# Altium schematic sheet Shema.SchDoc
size A3
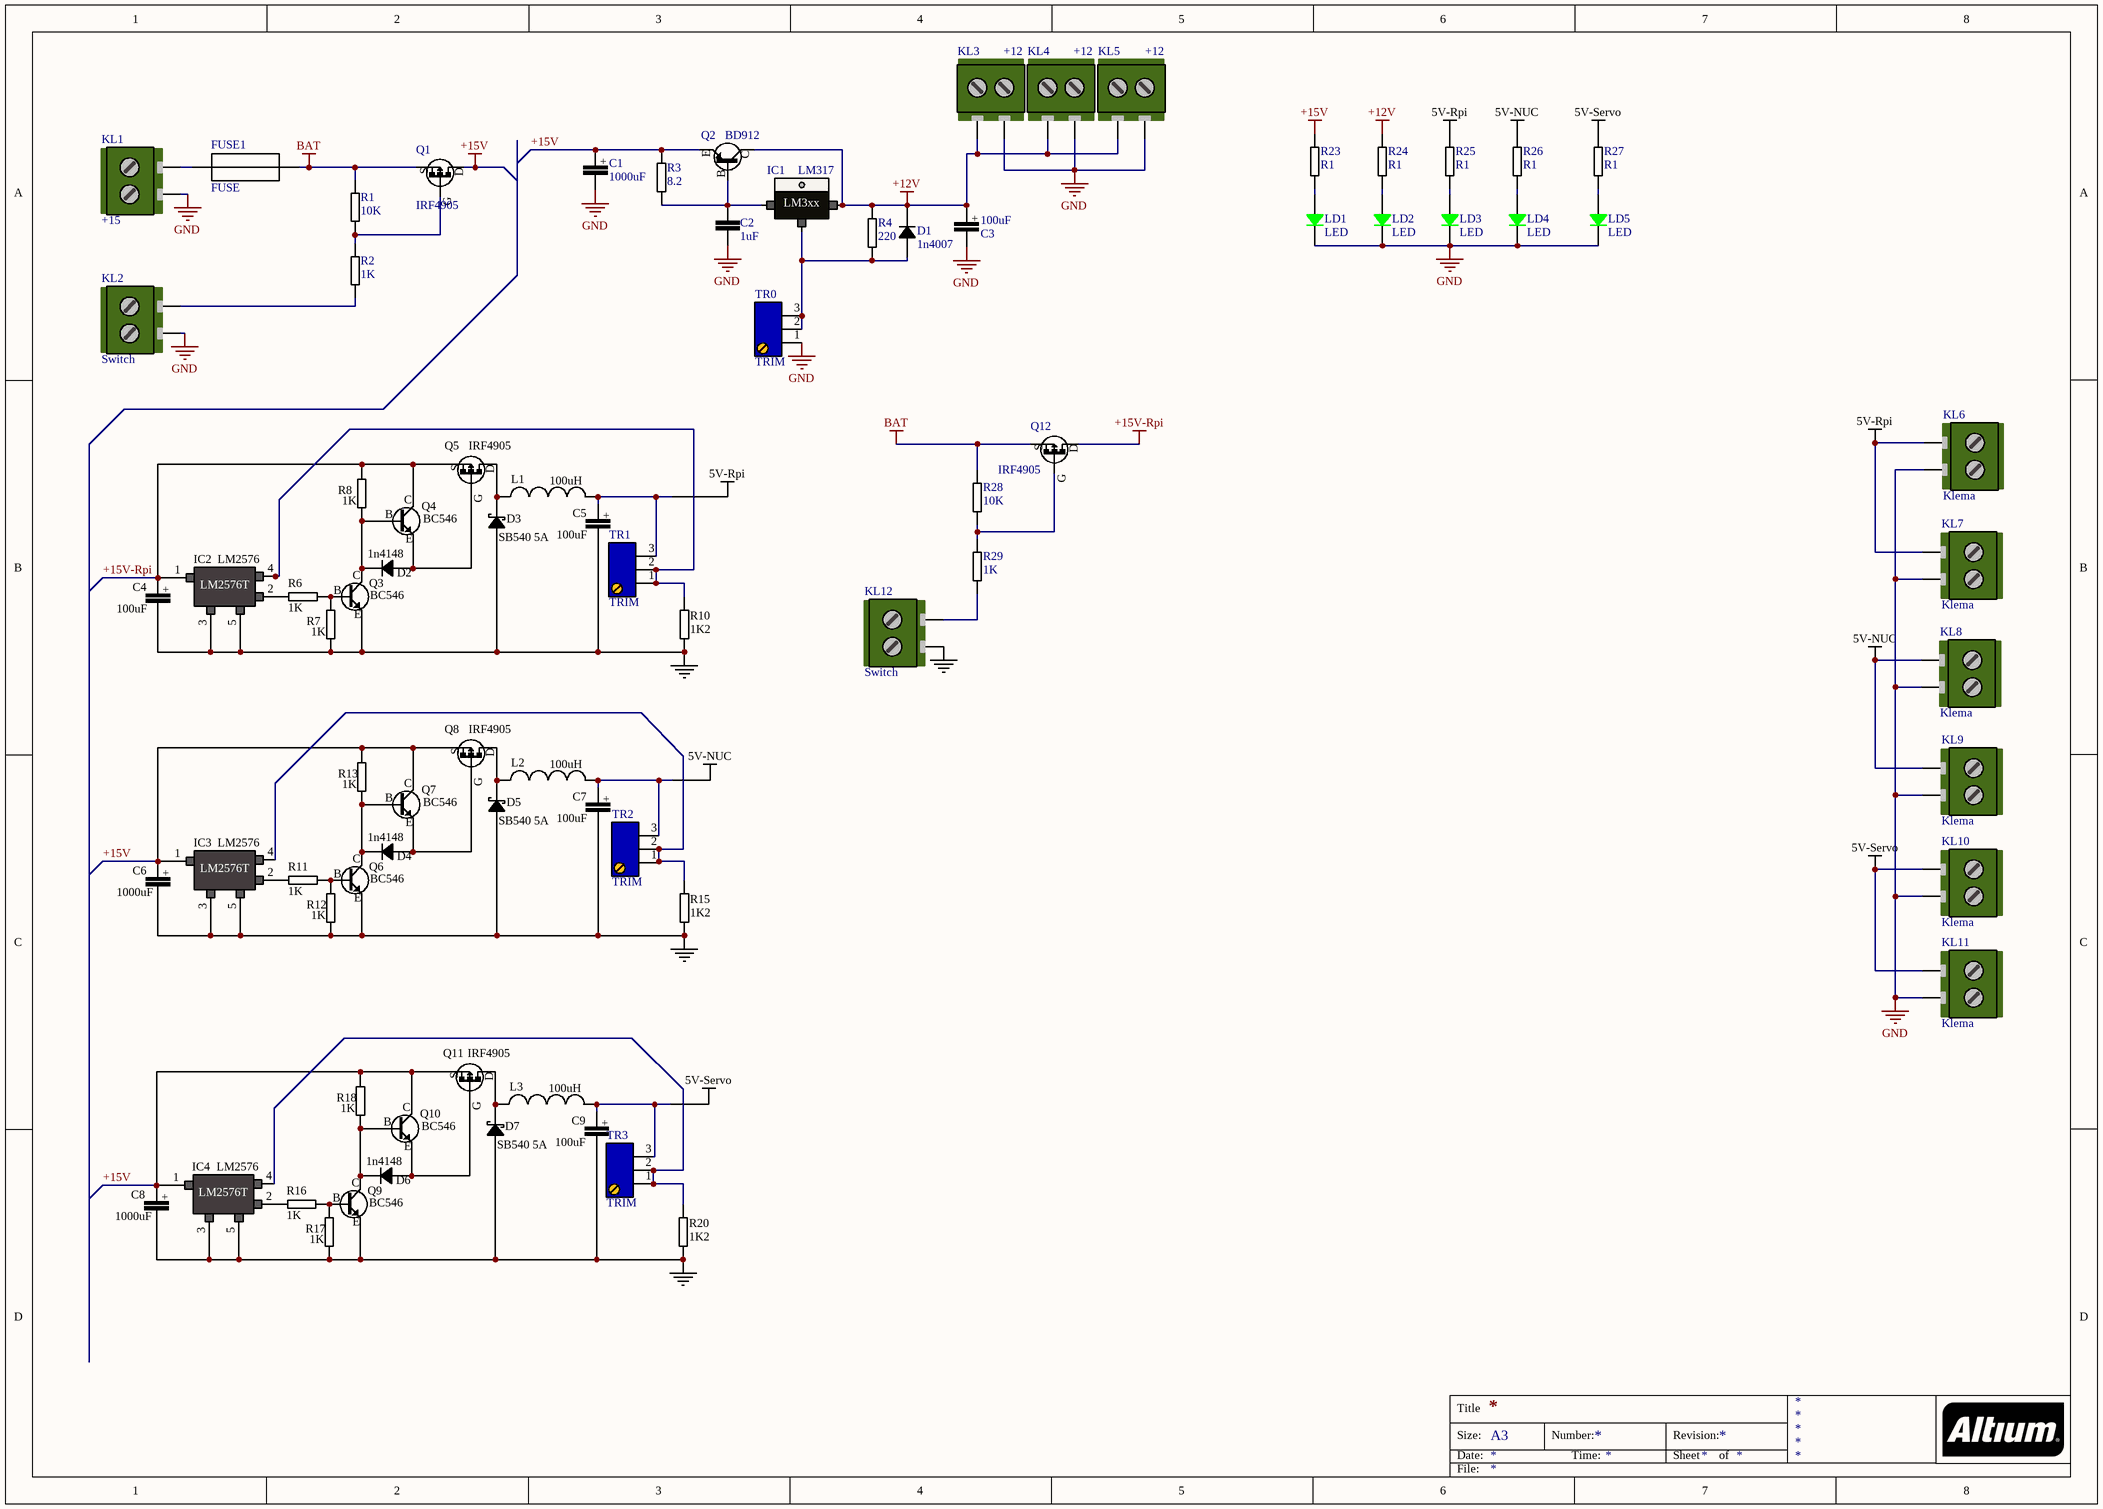
[diagram p0: Shema.SchDoc]

## Parts
100uF  C3  [C2(elektrolit)]
C1  1000uF  [C2(elektrolit)]
C2  1uF  [C1(ceramic)]
C4  100uF  [C2(elektrolit)]
C5  100uF  [C2(elektrolit)]
C6  1000uF  [C2(elektrolit)]
C7  100uF  [C2(elektrolit)]
C8  1000uF  [C2(elektrolit)]
C9  100uF  [C2(elektrolit)]
D1  1n4007  [D1(300milsa)]
D2  1n4148  [D1(300milsa)]
D3  SB540 5A  [D2(5A)]
D4  1n4148  [D1(300milsa)]
D5  SB540 5A  [D2(5A)]
D6  1n4148  [D1(300milsa)]
D7  SB540 5A  [D2(5A)]
FUSE1  FUSE  [Osigurac]
IC1  LM317  [TO220]
IC2  LM2576  [LM2576]
IC3  LM2576  [LM2576]
IC4  LM2576  [LM2576]
KL1  +15  [Klema]
KL2  Switch  [Klema]
KL3  +12  [Klema]
KL4  +12  [Klema]
KL5  +12  [Klema]
KL6  Klema  [Klema]
KL7  Klema  [Klema]
KL8  Klema  [Klema]
KL9  Klema  [Klema]
KL10  Klema  [Klema]
KL11  Klema  [Klema]
KL12  Switch  [Klema]
L1  100uH  [Coil(600mils)]
L2  100uH  [Coil(600mils)]
L3  100uH  [Coil(600mils)]
LD1  LED  [LED(3mm)]
LD2  LED  [LED(3mm)]
LD3  LED  [LED(3mm)]
LD4  LED  [LED(3mm)]
LD5  LED  [LED(3mm)]
Q1  IRF4905  [TO220]
Q2  BD912  [TO220]
Q3  BC546  [TO-92]
Q4  BC546  [TO-92]
Q5  IRF4905  [TO220]
Q6  BC546  [TO-92]
Q7  BC546  [TO-92]
Q8  IRF4905  [TO220]
Q9  BC546  [TO-92]
Q10  BC546  [TO-92]
Q11  IRF4905  [TO220]
Q12  IRF4905  [TO220]
R1  10K  [R1(300milsa)]
R2  1K  [R1(300milsa)]
R3  8.2  [R1(2W)]
R4  220  [R1(300milsa)]
R6  1K  [R1(300milsa)]
R7  1K  [R1(300milsa)]
R8  1K  [R1(300milsa)]
R10  1K2  [R1(300milsa)]
R11  1K  [R1(300milsa)]
R12  1K  [R1(300milsa)]
R13  1K  [R1(300milsa)]
R15  1K2  [R1(300milsa)]
R16  1K  [R1(300milsa)]
R17  1K  [R1(300milsa)]
R18  1K  [R1(300milsa)]
R20  1K2  [R1(300milsa)]
R23  R1  [R1(300milsa)]
R24  R1  [R1(300milsa)]
R25  R1  [R1(300milsa)]
R26  R1  [R1(300milsa)]
R27  R1  [R1(300milsa)]
R28  10K  [R1(300milsa)]
R29  1K  [R1(300milsa)]
TR0  TRIM  [TRIM]
TR1  TRIM  [TRIM]
TR2  TRIM  [TRIM]
TR3  TRIM  [TRIM]

## Nets
5V-NUC: C7.1 KL8.1 KL9.1 L2.2 R26.2 TR2.3
5V-Rpi: C5.1 KL6.1 KL7.1 L1.2 R25.2 TR1.3
5V-Servo: C9.1 KL10.1 KL11.1 L3.2 R27.2 TR3.3
+12V: 100uF.1 D1.2 IC1.2 KL3.1 KL4.1 KL5.1 Q2.3 R4.2 R24.2
+15V: C1.1 C6.1 C8.1 IC3.1 IC4.1 Q1.2 Q2.2 Q7.2 Q8.3 Q10.2 Q11.3 R3.2 R13.1 R18.1 R23.2
+15V-Rpi: C4.1 IC2.1 Q4.2 Q5.3 Q12.2 R8.1
BAT: FUSE1.2 Q1.3 Q12.3 R1.2 R28.2
GND: 100uF.2 C1.2 C2.1 C4.2 C5.2 C6.2 C7.2 C8.2 C9.2 D3.1 D5.1 D7.1 IC2.3 IC2.5 IC3.3 IC3.5 IC4.3 IC4.5 KL1.1 KL2.1 KL3.2 KL4.2 KL5.2 KL6.2 KL7.2 KL8.2 KL9.2 KL10.2 KL11.2 KL12.1 LD1.2 LD2.2 LD3.2 LD4.2 LD5.2 Q3.3 Q6.3 Q9.3 R7.2 R10.2 R12.2 R15.2 R17.2 R20.2 TR0.1
NetC2_2: C2.2 IC1.3 Q2.1 R3.1
NetD1_1: D1.1 IC1.1 R4.1 TR0.2 TR0.3
NetD2_1: D2.1 Q4.3 Q5.1
NetD2_2: D2.2 Q3.2 Q4.1 R8.2
NetD3_2: D3.2 L1.1 Q5.2
NetD4_1: D4.1 Q7.3 Q8.1
NetD4_2: D4.2 Q6.2 Q7.1 R13.2
NetD5_2: D5.2 L2.1 Q8.2
NetD6_1: D6.1 Q10.3 Q11.1
NetD6_2: D6.2 Q9.2 Q10.1 R18.2
NetD7_2: D7.2 L3.1 Q11.2
NetFUSE1_1: FUSE1.1 KL1.2
NetIC2_2: IC2.2 R6.2
NetIC2_4: IC2.4 R10.1 TR1.1 TR1.2
NetIC3_2: IC3.2 R11.2
NetIC3_4: IC3.4 R15.1 TR2.1 TR2.2
NetIC4_2: IC4.2 R16.2
NetIC4_4: IC4.4 R20.1 TR3.1 TR3.2
NetKL2_2: KL2.2 R2.1
NetKL12_2: KL12.2 R29.1
NetLD1_1: LD1.1 R23.1
NetLD2_1: LD2.1 R24.1
NetLD3_1: LD3.1 R25.1
NetLD4_1: LD4.1 R26.1
NetLD5_1: LD5.1 R27.1
NetQ1_1: Q1.1 R1.1 R2.2
NetQ3_1: Q3.1 R6.1 R7.1
NetQ6_1: Q6.1 R11.1 R12.1
NetQ9_1: Q9.1 R16.1 R17.1
NetQ12_1: Q12.1 R28.1 R29.2

## Notes on the sheet
- Title
- Size:
- Date:
- A3
- Number:
- Time:
- Revision:
- Sheet
- of
- File:
- (in symbol C2) +
- (in symbol LM317/LM350) LM3xx
- (in symbol LM2576) LM2576T
- (in symbol P-Channel MOSFET) S; D; G
- (in symbol Transistor NPN) C; B; E
- (in symbol Transistor PNP) E; C; B

## Library data of the parts
100uF C1 C4-C9 = C2
C2 = C1
D1 D2 D4 D6 = D1
D3 D5 D7 = Sotki Diode
IC1 = LM317/LM350
KL1-KL5 KL12 = Klema
L1-L3 = Coil
Q1 Q5 Q8 Q11 Q12 = P-Channel MOSFET
Q2 = Transistor PNP
Q3 Q4 Q6 Q7 Q9 Q10 = Transistor NPN
R1-R4 R6-R8 R10-R13 R15-R18 R20 R28 R29 = R1